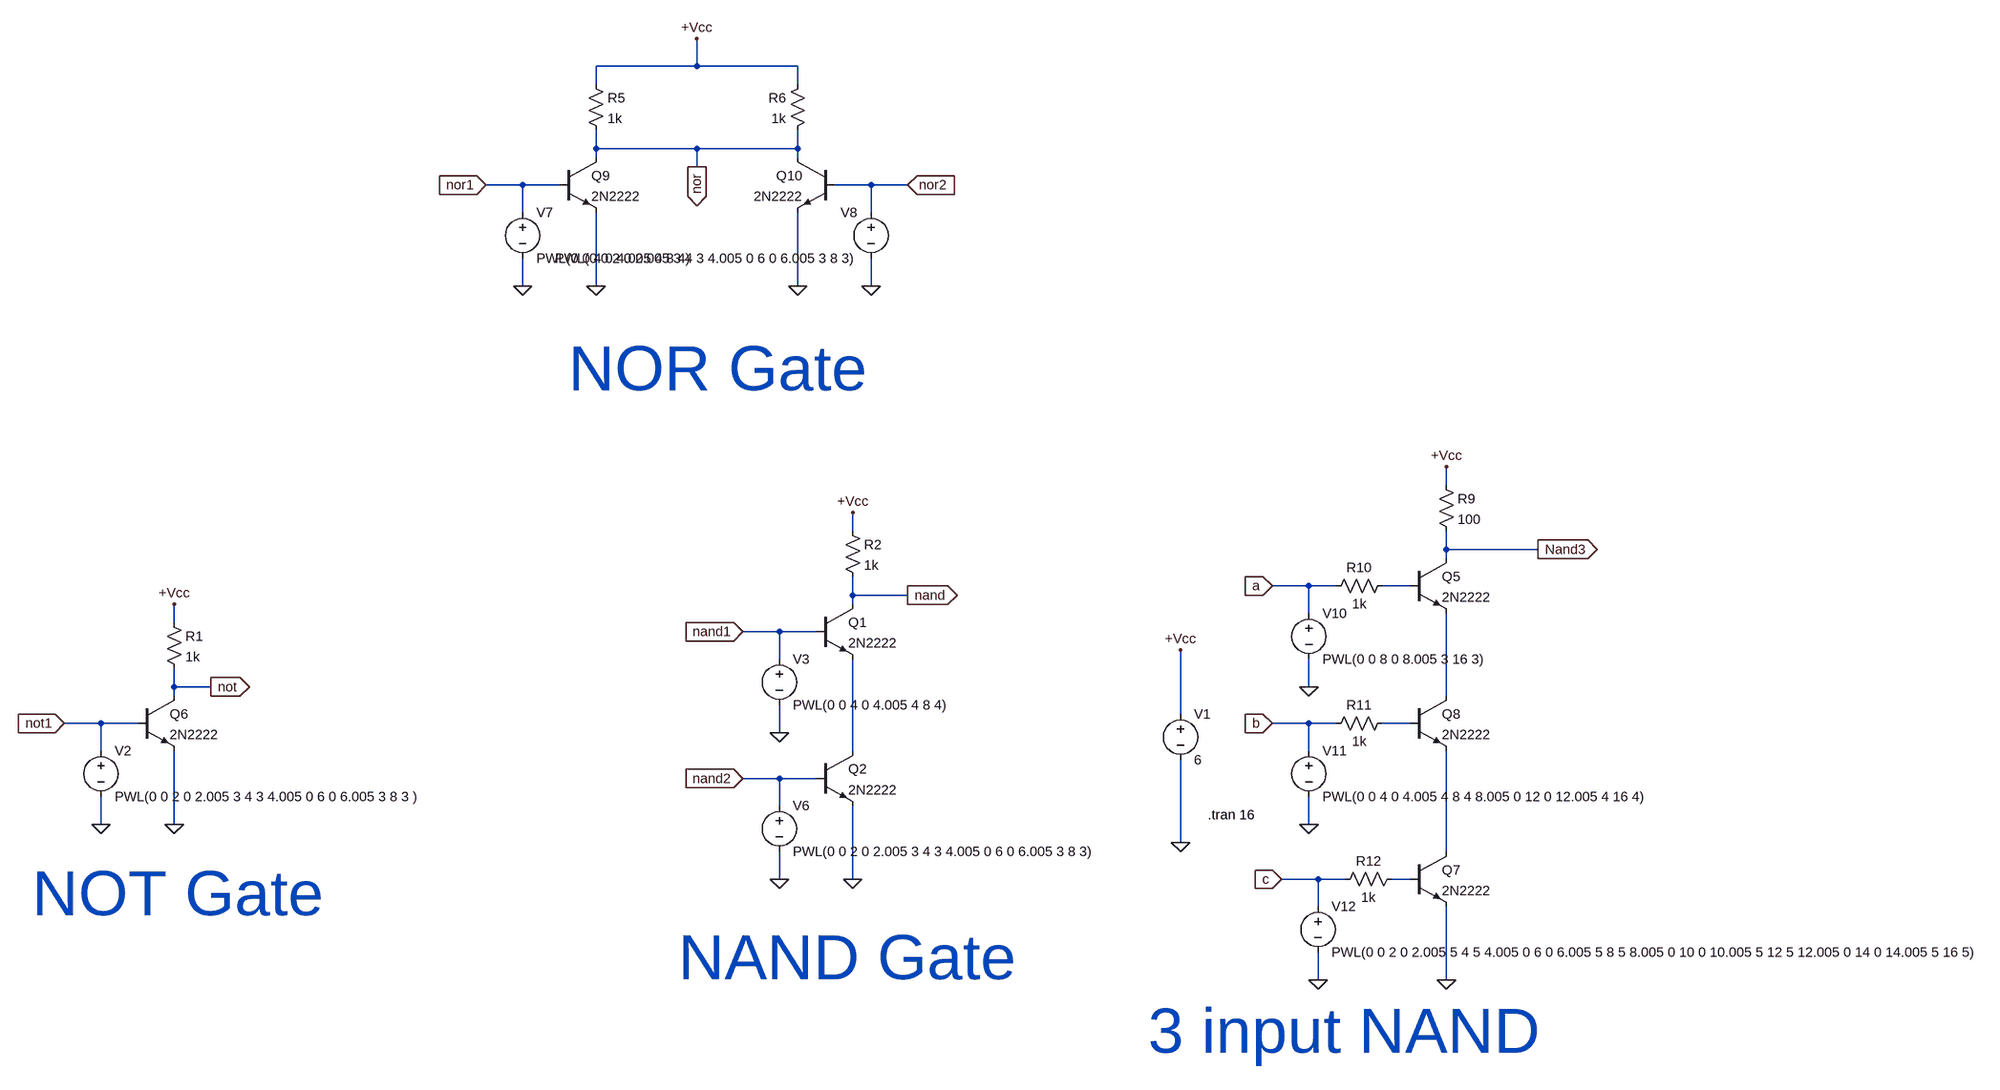
[diagram p0: schematic Gates using BJT.asc]
Gates using BJT.asc, the LTspice schematic file:
Version 4
SHEET 1 3040 1416
WIRE 448 -1040 448 -1088
WIRE 448 -1040 272 -1040
WIRE 624 -1040 448 -1040
WIRE 272 -1008 272 -1040
WIRE 624 -1008 624 -1040
WIRE 272 -896 272 -928
WIRE 448 -896 272 -896
WIRE 624 -896 624 -928
WIRE 624 -896 448 -896
WIRE 272 -880 272 -896
WIRE 624 -880 624 -896
WIRE 448 -864 448 -896
WIRE 144 -832 80 -832
WIRE 208 -832 144 -832
WIRE 752 -832 688 -832
WIRE 816 -832 752 -832
WIRE 144 -784 144 -832
WIRE 752 -784 752 -832
WIRE 144 -656 144 -704
WIRE 272 -656 272 -784
WIRE 624 -656 624 -784
WIRE 752 -656 752 -704
WIRE 2016 -208 2016 -240
WIRE 720 -128 720 -160
WIRE 2016 -96 2016 -128
WIRE 2176 -96 2016 -96
WIRE 2016 -80 2016 -96
WIRE 1776 -32 1712 -32
WIRE 1824 -32 1776 -32
WIRE 1952 -32 1904 -32
WIRE 720 -16 720 -48
WIRE 816 -16 720 -16
WIRE 720 0 720 -16
WIRE 1776 16 1776 -32
WIRE -464 32 -464 0
WIRE 592 48 528 48
WIRE 656 48 592 48
WIRE 592 96 592 48
WIRE -464 144 -464 112
WIRE -400 144 -464 144
WIRE 1776 144 1776 96
WIRE -464 160 -464 144
WIRE 2016 160 2016 16
WIRE 1552 192 1552 80
WIRE -592 208 -656 208
WIRE -528 208 -592 208
WIRE 1776 208 1712 208
WIRE 1824 208 1776 208
WIRE 1952 208 1904 208
WIRE 592 224 592 176
WIRE -592 256 -592 208
WIRE 720 256 720 96
WIRE 1776 256 1776 208
WIRE 592 304 528 304
WIRE 656 304 592 304
WIRE 592 352 592 304
WIRE -592 384 -592 336
WIRE -464 384 -464 256
WIRE 1776 384 1776 336
WIRE 1552 416 1552 272
WIRE 2016 432 2016 256
WIRE 592 480 592 432
WIRE 720 480 720 352
WIRE 1792 480 1728 480
WIRE 1840 480 1792 480
WIRE 1952 480 1920 480
WIRE 1792 528 1792 480
WIRE 1792 656 1792 608
WIRE 2016 656 2016 528
FLAG -592 384 0
FLAG -464 384 0
FLAG -464 0 +Vcc
FLAG -656 208 not1
IOPIN -656 208 In
FLAG -400 144 not
IOPIN -400 144 Out
FLAG 2016 -240 +Vcc
FLAG 2016 656 0
FLAG 1776 144 0
FLAG 1712 -32 a
IOPIN 1712 -32 In
FLAG 1776 384 0
FLAG 1712 208 b
IOPIN 1712 208 In
FLAG 1792 656 0
FLAG 1728 480 c
IOPIN 1728 480 In
FLAG 2176 -96 Nand3
IOPIN 2176 -96 Out
FLAG 144 -656 0
FLAG 272 -656 0
FLAG 80 -832 nor1
IOPIN 80 -832 In
FLAG 752 -656 0
FLAG 624 -656 0
FLAG 816 -832 nor2
IOPIN 816 -832 In
FLAG 448 -864 nor
IOPIN 448 -864 Out
FLAG 448 -1088 +Vcc
FLAG 592 224 0
FLAG 528 48 nand1
IOPIN 528 48 In
FLAG 816 -16 nand
IOPIN 816 -16 Out
FLAG 720 -160 +Vcc
FLAG 592 480 0
FLAG 720 480 0
FLAG 528 304 nand2
IOPIN 528 304 In
FLAG 1552 80 +Vcc
FLAG 1552 416 0
SYMBOL npn -528 160 R0
SYMATTR InstName Q6
SYMATTR Value 2N2222
SYMBOL voltage -592 240 R0
SYMATTR InstName V2
SYMATTR Value PWL(0 0 2 0 2.005 3 4 3 4.005 0 6 0 6.005 3 8 3 )
SYMBOL Res -480 16 R0
SYMATTR InstName R1
SYMATTR Value 1k
SYMBOL npn 1952 -80 R0
SYMATTR InstName Q5
SYMATTR Value 2N2222
SYMBOL Res 2000 -224 R0
SYMATTR InstName R9
SYMATTR Value 100
SYMBOL npn 1952 432 R0
SYMATTR InstName Q7
SYMATTR Value 2N2222
SYMBOL npn 1952 160 R0
SYMATTR InstName Q8
SYMATTR Value 2N2222
SYMBOL Res 1920 -48 R90
WINDOW 0 0 56 VBottom 2
WINDOW 3 32 56 VTop 2
SYMATTR InstName R10
SYMATTR Value 1k
SYMBOL voltage 1776 0 R0
SYMATTR InstName V10
SYMATTR Value PWL(0 0 8 0 8.005 3 16 3)
SYMBOL Res 1920 192 R90
WINDOW 0 0 56 VBottom 2
WINDOW 3 32 56 VTop 2
SYMATTR InstName R11
SYMATTR Value 1k
SYMBOL voltage 1776 240 R0
SYMATTR InstName V11
SYMATTR Value PWL(0 0 4 0 4.005 4 8 4 8.005 0 12 0 12.005 4 16 4)
SYMBOL Res 1936 464 R90
WINDOW 0 0 56 VBottom 2
WINDOW 3 32 56 VTop 2
SYMATTR InstName R12
SYMATTR Value 1k
SYMBOL voltage 1792 512 R0
SYMATTR InstName V12
SYMATTR Value PWL(0 0 2 0 2.005 5 4 5 4.005 0 6 0 6.005 5 8 5 8.005 0 10 0 10.005 5 12 5 12.005 0 14 0 14.005 5 16 5)
SYMBOL npn 208 -880 R0
SYMATTR InstName Q9
SYMATTR Value 2N2222
SYMBOL voltage 144 -800 R0
SYMATTR InstName V7
SYMATTR Value PWL(0 0 4 0 4.005 4 8 4)
SYMBOL Res 256 -1024 R0
SYMATTR InstName R5
SYMATTR Value 1k
SYMBOL npn 688 -880 M0
SYMATTR InstName Q10
SYMATTR Value 2N2222
SYMBOL voltage 752 -800 M0
SYMATTR InstName V8
SYMATTR Value PWL(0 0 2 0 2.005 3 4 3 4.005 0 6 0 6.005 3 8 3)
SYMBOL Res 640 -1024 M0
SYMATTR InstName R6
SYMATTR Value 1k
SYMBOL npn 656 0 R0
SYMATTR InstName Q1
SYMATTR Value 2N2222
SYMBOL voltage 592 80 R0
SYMATTR InstName V3
SYMATTR Value PWL(0 0 4 0 4.005 4 8 4)
SYMBOL Res 704 -144 R0
SYMATTR InstName R2
SYMATTR Value 1k
SYMBOL npn 656 256 R0
SYMATTR InstName Q2
SYMATTR Value 2N2222
SYMBOL voltage 592 336 R0
SYMATTR InstName V6
SYMATTR Value PWL(0 0 2 0 2.005 3 4 3 4.005 0 6 0 6.005 3 8 3)
SYMBOL voltage 1552 176 R0
SYMATTR InstName V1
SYMATTR Value 6
TEXT -712 504 Left 7 ;NOT Gate
TEXT 224 -512 Left 7 ;NOR Gate
TEXT 416 616 Left 7 ;NAND Gate
TEXT 1600 368 Left 2 !.tran 16
TEXT 1496 744 Left 7 ;3 input NAND

The netlist it stands for:
* Gates using BJT.asc
Q6 not not1 0 0 2N2222
V2 not1 0 PWL(0 0 2 0 2.005 3 4 3 4.005 0 6 0 6.005 3 8 3 )
R1 +Vcc not 1k
Q5 Nand3 N001 N002 0 2N2222
R9 +Vcc Nand3 100
Q7 N005 N006 0 0 2N2222
Q8 N002 N003 N005 0 2N2222
R10 N001 a 1k
V10 a 0 PWL(0 0 8 0 8.005 3 16 3)
R11 N003 b 1k
V11 b 0 PWL(0 0 4 0 4.005 4 8 4 8.005 0 12 0 12.005 4 16 4)
R12 N006 c 1k
V12 c 0 PWL(0 0 2 0 2.005 5 4 5 4.005 0 6 0 6.005 5 8 5 8.005 0 10 0 10.005 5 12 5 12.005 0 14 0 14.005 5 16 5)
Q9 nor nor1 0 0 2N2222
V7 nor1 0 PWL(0 0 4 0 4.005 4 8 4)
R5 +Vcc nor 1k
Q10 nor nor2 0 0 2N2222
V8 nor2 0 PWL(0 0 2 0 2.005 3 4 3 4.005 0 6 0 6.005 3 8 3)
R6 +Vcc nor 1k
Q1 nand nand1 N004 0 2N2222
V3 nand1 0 PWL(0 0 4 0 4.005 4 8 4)
R2 +Vcc nand 1k
Q2 N004 nand2 0 0 2N2222
V6 nand2 0 PWL(0 0 2 0 2.005 3 4 3 4.005 0 6 0 6.005 3 8 3)
V1 +Vcc 0 6
.model NPN NPN
.model PNP PNP
.lib standard.bjt
* NOT Gate
* NOR Gate
* NAND Gate
.tran 16
* 3 input NAND
.backanno
.end